# Altium schematic sheet Sensors.SchDoc
size A; DocumentNumber: 4; SheetNumber: 4; SheetTotal: 5
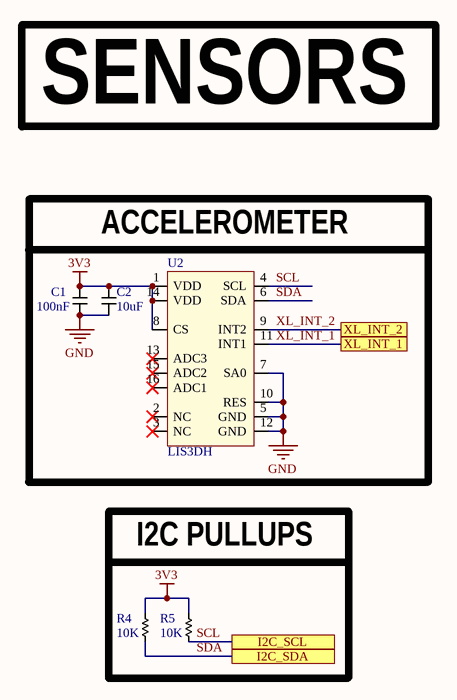
[diagram p0: Sensors.SchDoc]

## Parts
C1  100nF  [CAP_0603_HIGH]
C2  10uF  [CAP_0603_HIGH]
R4  10K  [RES_0603_HIGH]
R5  10K  [RES_0603_HIGH]
U2  LIS3DH  [LIS3DH]

## Blocks framed on the sheet
ACCELEROMETER: C1 C2 U2
I2C PULLUPS: R4 R5

## Ports
I2C_SCL, I2C_SDA, XL_INT_1, XL_INT_2

## Nets
3V3: C1.1 C2.1 R4.2 R5.2 U2.1(VDD) U2.8(CS) U2.14(VDD)
GND: C1.2 C2.2 U2.5(GND) U2.7(SA0) U2.10(RES) U2.12(GND)
SCL: R5.1 U2.4(SCL) ; port I2C_SCL
SDA: R4.1 U2.6(SDA) ; port I2C_SDA
XL_INT_1: U2.11(INT1) ; port XL_INT_1
XL_INT_2: U2.9(INT2) ; port XL_INT_2

Not connected (* = marked no-connect by the designer): U2 2(NC)* 3(NC)* 13(ADC3)* 15(ADC2)* 16(ADC1)*

## Notes on the sheet
- SENSORS

## Library data of the parts
C1 C2 = Capacitor_0603: 0603 Capacitor
R4 R5 = Resistor_0603: 0603 Resistor
U2 = LIS3DH: LIS3DH ACCEL 2-16G I2C/SPI 16LGA